# Altium project Common_Sensor_Box.PrjPCB (part 6 of 17)

## Sheet Sensor_Box_PWR_DC.SchDoc: Title
size 420 x 297 mm; Author: G.Kasprowicz; CompanyName: WUT ISE; DrawnBy: G.Kasprowicz; Organization: WUT ISE; Address1: PW ISE; Address2: Nowowiejska 15/19 00-665 Warsaw; Address3: gkasprow@gmail.com; Revision: 1.0; SheetNumber: -; SheetTotal: -; ModifiedBy: -; CheckedDate: -; Title2: Title2; DivGrp: WUT ISE; Designer: G.Kasprowicz; ModifiedDate: -; ProjectName: Sensor Box
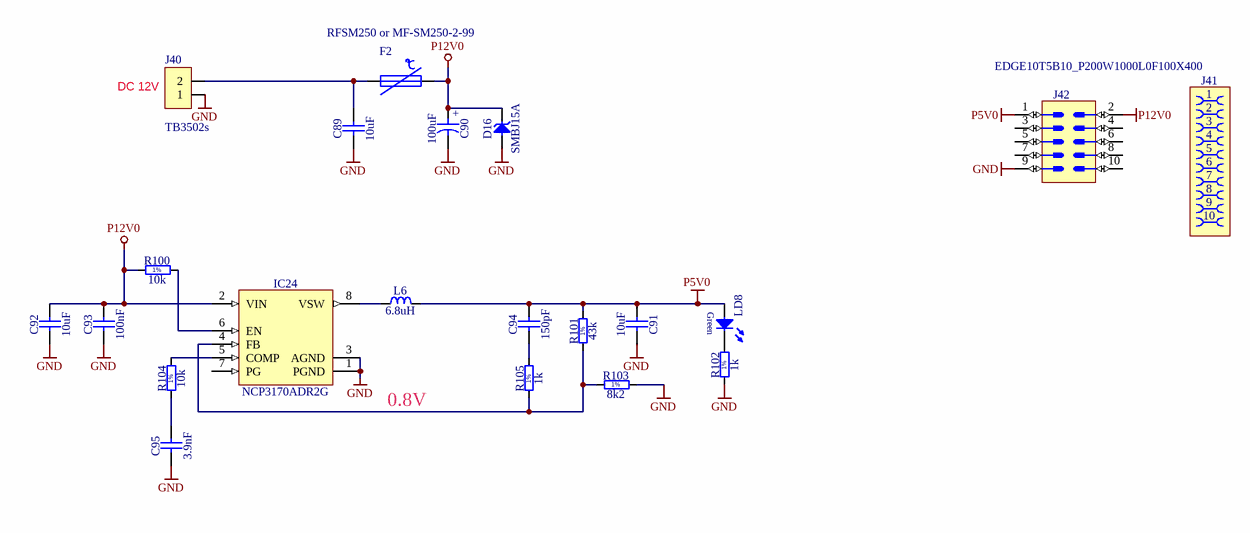
[diagram p9: Sensor_Box_PWR_DC.SchDoc]

### Parts
C89  10uF  [CAPC2012X135N]
C90  100uF  [CAPAE660X540N]
C91  10uF  [CAPC2012X135N]
C92  10uF  [CAPC2012X135N]
C93  100nF  [CAPC1005X55N]
C94  150pF  [CAPC1608X87N]
C95  3.9nF  [CAPC1608X87N]
D16  SMBJ15A  [DIOM5336X265N]
F2  RFSM250 or MF-SM250-2-99  [SMD150-2]
IC24  NCP3170ADR2G  [SOIC127P600X175-8N]
J40  TB3502s  [tbx3502s]
J41  (no value)  [AVX_00 9159 010 061 916]
J42  (no value)  [EDGE10T5B10_P200W1000L0F100X400]
L6  6.8uH  [IND_BOURNS_SRU8043]
LD8  Green  [LED_KINGBRIGHT_KPTR3216]  (value not drawn)
R100  10k  [RESC1005X40N]
R101  43k  [RESC1608X55N]
R102  1k  [RESC1005X40N]
R103  8k2  [RESC1608X55N]
R104  10k  [RESC1005X40N]
R105  1k  [RESC1005X40N]

### Nets
GND: C89.1 C90.2 C91.2 C92.1 C93.1 C95.1 D16.2(A) IC24.1(PGND) IC24.3(AGND) J40.1 J42.9 R102.1 R103.2
P5V0: C91.1 C94.2 J42.1 L6.2 LD8.2(A) R101.2
P12V0: C90.1 C92.2 C93.2 D16.1(C) F2.2 IC24.2(VIN) J42.2 R100.1
NetC89_2: C89.2 F2.1 J40.2
NetC94_1: C94.1 R105.2
NetC95_2: C95.2 R104.1
NetIC24_4: IC24.4(FB) R101.1 R103.1 R105.1
NetIC24_5: IC24.5(COMP) R104.2
NetIC24_6: IC24.6(EN) R100.2
NetIC24_8: IC24.8(VSW) L6.1
NetLD8_1: LD8.1(C) R102.2

Not connected (* = marked no-connect by the designer): IC24 7(PG); J42 3 4 5 6 7 8 10

### Notes on the sheet
- (near J40) DC 12V
- 0.8V
- Project/Equipment
- Document
- Designer
- Drawn by
- Check.by
- Copyright WUT ISE 2018.
  This documentation describes Open Hardware and is licensed under the CERN OHL v.1.1. You may redistribute and modify this documentation under the terms of the CERN OHL v.1.1. (http://ohwr.org/CERNOHL). This documentation is distributed WITHOUT ANY EXPRESS OR IMPLIED WARRANTY, INCLUDING OF MERCHANTABILITY, SATISFACTORY QUALITY AND FITNESS FOR A PARTICULAR PURPOSE. Please see the CERN OHL v.1.1 for applicable conditions.
- Contact
- File
- Last Mod.
- Print Date
- Sheet
- Size
- A3
- of
- Rev
- (in symbol CAE660-540_100UF_16V_20%) +
- (in symbol R0402_1K_1%_0.0625W_100PPM) 1%
- (in symbol R0402_10K_1%_0.0625W_100PPM) 1%
- (in symbol R0603_8K2_1%_0.1W_100PPM) 1%
- (in symbol R0603_43K_1%_0.1W_100PPM) 1%

### Library data of the parts
C89 C91 C92 = CC0805_10UF_16V_10%_X5R: as C56 on sheet Sensor_Box_Hub_SAMD21; Part Number: CC0805_10UF_16V_10%_X5R; Component Kind: Standard; Component Type: Standard; Pin Count: 2; Value: 10uF; Status: Preferred; Manufacturer Part Number: CC0805_10UF_16V_10%_X5R; Case: 0805; Mounted: Yes; Socket: No; SMD: Yes; Sense: No; Manufacturer1 Example: KEMET; Manufacturer1 ComponentHeight: 1.4mm; HelpURL: \\cern.ch\dfs\Applications\Altium\Datasheets\CC1206_X5R_KEMET.pdf; Author: CERN DEM JLC; CreateDate: 03.12.2007; LatestRevisionDate: 03.12.2007
C90 = CAE660-540_100UF_16V_20%: as C58 on sheet Sensor_Box_PoE; Part Number: CAE660-540_100UF_16V_20%; Component Kind: Standard; Component Type: Standard; Pin Count: 2; Value: 100uF; Status: Not Recommended; Case: D; Mounted: Yes; Socket: No; SMD: Yes; Sense: No; ComponentHeight: 5.8mm; HelpURL: \\cern.ch\dfs\Applications\Altium\Datasheets\CAE_PANASONIC_FK.pdf; Author: CERN DEM JLC; CreateDate: 03.12.2007; LatestRevisionDate: 05.11.2014
C93 = CC0402_100NF_16V_10%_X5R: as C41 on sheet Sensor_Box_Hub_SAMD21; Part Number: CC0402_100NF_16V_10%_X5R; Component Kind: Standard; Component Type: Standard; Pin Count: 2; Value: 100nF; Status: None; Manufacturer Part Number: CC0402_100NF_16V_10%_X5R; Case: 0402; Mounted: Yes; Socket: No; SMD: Yes; Sense: No; Manufacturer1 Example: MURATA; Manufacturer1 ComponentHeight: 0.55mm; HelpURL: \\cern.ch\dfs\Applications\Altium\Datasheets\CC0402_X5R_MURATA_GRM.pdf; Author: CERN DEM JLC; CreateDate: 10.12.2013; LatestRevisionDate: 10.12.2013
C94 = CC0603_150PF_50V_1%_NP0: as C81 on sheet Sensor_Box_PoE; Part Number: CC0603_150PF_50V_1%_NP0; Component Kind: Standard; Component Type: Standard; Pin Count: 2; Value: 150pF; Status: None; Manufacturer Part Number: CC0603_150PF_50V_1%_NP0; Case: 0603; Mounted: Yes; Socket: No; SMD: Yes; Sense: No; Manufacturer1 Example: PHYCOMP; Manufacturer1 ComponentHeight: 0.7mm; HelpURL: \\cern.ch\dfs\Applications\Altium\Datasheets\CC0805_NP0_PHYCOMP_16VTO50V.pdf; Author: CERN DEM MR; CreateDate: 17.02.2016; LatestRevisionDate: 17.02.2016
C95 = CC0603_3.9NF_50V_5%_X7R: as C69#1 on sheet Sensor_Box_PoE; Part Number: CC0603_3.9NF_50V_5%_X7R; Component Kind: Standard; Component Type: Standard; Pin Count: 2; Value: 3.9nF; Status: Preferred; Manufacturer Part Number: CC0603_3.9NF_50V_5%_X7R; Case: 0603; Mounted: Yes; Socket: No; SMD: Yes; Sense: No; Manufacturer1 Example: PHYCOMP; Manufacturer1 ComponentHeight: 0.87mm; HelpURL: \\cern.ch\dfs\Applications\Altium\Datasheets\CC0603_X7R_PHYCOMP.pdf; Author: CERN DEM JLC; CreateDate: 03.12.2007; LatestRevisionDate: 03.12.2007
D16 = SMBJ15A: Zener Diode; Part Description: Uni-Directional Transient Voltage Suppressor Diode; Manufacturer: FAIRCHILD SEMICONDUCTOR; Voltage: 15V; Power: 600W; PressFit: No; Bonding: No; Part Number: SMBJ15A; Component Kind: Standard; Component Type: Standard; Device: SMBJ15A; PackageDescription: DO-214-AA/SMB Diode, Molded Body; 5.34mm L X 3.625mm W X 2.65mm H, IPC Medium Density; Manufacturer Part Number: SMBJ15A; Pin Count: 2; Case: DO-214AA; Mounted: Yes; Socket: No; SMD: Yes; Sense: No; ComponentHeight: 2.65mm; HelpURL: \\cern.ch\dfs\Applications\Altium\Datasheets\SMBJ.pdf; Author: CERN DEM JLC; CreateDate: 08.12.2008; LatestRevisionDate: 19.12.2011
F2 = F_PTC_9.5x6mm: 2.50A/15V; Supplier 1: Newark; Supplier Part Number 1: 61J7435
IC24 = NCP3170ADR2G: as IC21 on sheet Sensor_Box_PoE; Part Number: NCP3170ADR2G; Component Kind: Standard; Component Type: Standard; Device: NCP3170ADR2G; PackageDescription: SOIC 8, Pitch 1.27mm - Body 4x5mm, IPC Medium Density; Part Description: Synchronous PWM Switching Converter; Manufacturer Part Number: NCP3170ADR2G; Pin Count: 8; Case: SOIC8; Mounted: Yes; Socket: No; SMD: Yes; Sense: No; ComponentHeight: 1.75mm; Author: CERN DEM MR; HelpURL: \\cern.ch\dfs\Applications\Altium\Datasheets\NCP3170ADR2G.pdf; CreateDate: 30.05.2016; LatestRevisionDate: 30.05.2016
J40 = CON_TB2: Terminal Block
J41 = AVX_00 9159 010 061 916: as J32 on sheet Sensor_Box_PoE; Part Number: AVX_00 9159 010 061 916; Component Kind: Standard; Component Type: Standard; Pin Count: 10; Mounted: Yes; Socket: No; SMD: No; Sense: No; Status: None; Manufacturer Part Number: 00 9159 010 061 916; ComponentHeight: 1.6mm; HelpURL: \\cern.ch\dfs\Applications\Altium\Datasheets\AVX_00 9159 010 061 916.pdf; Author: CERN DEM MR; CreateDate: 13.02.2018; LatestRevisionDate: 13.02.2018
J42 = EDGE10T5B10_P200W1000L0F100X400: as J26 on sheet Sensor_Box_Hub_SAMD21; Part Number: EDGE10T5B10_P200W1000L0F100X400; Component Kind: Standard (No BOM); Component Type: Standard (No BOM); Pin Count: 10; Socket: No; SMD: No; Sense: No; Status: None; ComponentHeight: 0mm; HelpURL: \\cern.ch\dfs\Applications\Altium\Datasheets\EDGE10T5B10_P200W1000L0F100X400.pdf; Author: CERN DEM MR; CreateDate: 14.02.2018; LatestRevisionDate: 14.02.2018
L6 = IND_6.8UH_30%_BOURNS_SRU8043: as L4 on sheet Sensor_Box_PoE; Part Number: IND_6.8UH_30%_BOURNS_SRU8043; Component Kind: Standard; Component Type: Standard; Pin Count: 2; Value: 6.8uH; Status: None; Mounted: Yes; Socket: No; SMD: Yes; Sense: No; ComponentHeight: 4.6mm; HelpURL: \\cern.ch\dfs\Applications\Altium\Datasheets\IND_BOURNS_SRU8043.pdf; Author: CERN DEM JMW; CreateDate: 06.08.2015; LatestRevisionDate: 06.08.2015
LD8 = LED_KINGBRIGHT_KPTR-3216CGCK: as LD3-LD5 on sheet Sensor_Box_Hub_SAMD21; Part Number: LED_KINGBRIGHT_KPTR-3216CGCK; Component Kind: Standard; Component Type: Standard; Color: Green; PackageDescription: Reverse Mount LED 3216, Hole 2.1x2.3mm 0.35mm Height; Manufacturer: KINGBRIGHT; Manufacturer Part Number: KPTR-3216CGCK; Pin Count: 2; Mounted: Yes; Socket: No; SMD: Yes; Sense: No; ComponentHeight: 0.35mm; HelpURL: \\cern.ch\dfs\Applications\Altium\Datasheets\LED_KINGBRIGHT_KPTR-3216CGCK.pdf; Author: CERN DEM MR; CreateDate: 15.02.2016; LatestRevisionDate: 15.02.2016
R100 R104 = R0402_10K_1%_0.0625W_100PPM: as R56 on sheet Sensor_Box_Hub_SAMD21; Part Number: R0402_10K_1%_0.0625W_100PPM; Component Kind: Standard; Component Type: Standard; Pin Count: 2; Value: 10k; Status: Not Recommended; Power: 0.0625W; Tolerance: ±1%; Manufacturer Part Number: R0402_10K_1%_0.0625W_100PPM; Case: 0402; Mounted: Yes; Sense: No; Socket: No; SMD: Yes; Manufacturer1 Example: YAGEO PHYCOMP; Manufacturer1 ComponentHeight: 0.4mm; HelpURL: \\cern.ch\dfs\Applications\Altium\Datasheets\R0402_Phycomp_RC0402.pdf; Author: CERN DEM JLC; CreateDate: 03.12.2007; LatestRevisionDate: 17.10.2012
R101 = R0603_43K_1%_0.1W_100PPM: as R90 on sheet Sensor_Box_PoE; Part Number: R0603_43K_1%_0.1W_100PPM; Component Kind: Standard; Component Type: Standard; Pin Count: 2; Value: 43k; Status: Preferred; Tolerance: ±1%; Manufacturer Part Number: R0603_43K_1%_0.1W_100PPM; Case: 0603; Mounted: Yes; Sense: No; Socket: No; SMD: Yes; Manufacturer1 Example: NIC COMPONENT; Manufacturer1 ComponentHeight: 0.55mm; HelpURL: \\cern.ch\dfs\Applications\Altium\Datasheets\R0603_NIC_NRC.pdf; Author: CERN DEM JLC; CreateDate: 03.12.2007; LatestRevisionDate: 13.03.2008
R102 R105 = R0402_1K_1%_0.0625W_100PPM: as R12 on sheet Sensor_Box_Hub_SAMD21; Part Number: R0402_1K_1%_0.0625W_100PPM; Component Kind: Standard; Component Type: Standard; Pin Count: 2; Value: 1k; Status: Not Recommended; Power: 0.0625W; Tolerance: ±1%; Manufacturer Part Number: R0402_1K_1%_0.0625W_100PPM; Case: 0402; Mounted: Yes; Sense: No; Socket: No; SMD: Yes; Manufacturer1 Example: YAGEO PHYCOMP; Manufacturer1 ComponentHeight: 0.4mm; HelpURL: \\cern.ch\dfs\Applications\Altium\Datasheets\R0402_Phycomp_RC0402.pdf; Author: CERN DEM JLC; CreateDate: 03.12.2007; LatestRevisionDate: 17.10.2012
R103 = R0603_8K2_1%_0.1W_100PPM: as R91 on sheet Sensor_Box_PoE; Part Number: R0603_8K2_1%_0.1W_100PPM; Component Kind: Standard; Component Type: Standard; Pin Count: 2; Value: 8k2; Status: Preferred; Tolerance: ±1%; Manufacturer Part Number: R0603_8K2_1%_0.1W_100PPM; Case: 0603; Mounted: Yes; Sense: No; Socket: No; SMD: Yes; Manufacturer1 Example: NIC COMPONENT; Manufacturer1 ComponentHeight: 0.55mm; HelpURL: \\cern.ch\dfs\Applications\Altium\Datasheets\R0603_NIC_NRC.pdf; Author: CERN DEM JLC; CreateDate: 03.12.2007; LatestRevisionDate: 13.03.2008

## Sheet Sensor_Box_IO_Relay.SchDoc: Title
size 420 x 297 mm; Author: G.Kasprowicz; CompanyName: WUT ISE; DrawnBy: G.Kasprowicz; Organization: WUT ISE; Address1: PW ISE; Address2: Nowowiejska 15/19 00-665 Warsaw; Address3: gkasprow@gmail.com; Revision: 1.0; SheetNumber: -; SheetTotal: -; ModifiedBy: -; CheckedDate: -; Title2: Title2; DivGrp: WUT ISE; Designer: G.Kasprowicz; ModifiedDate: -; ProjectName: Sensor Box
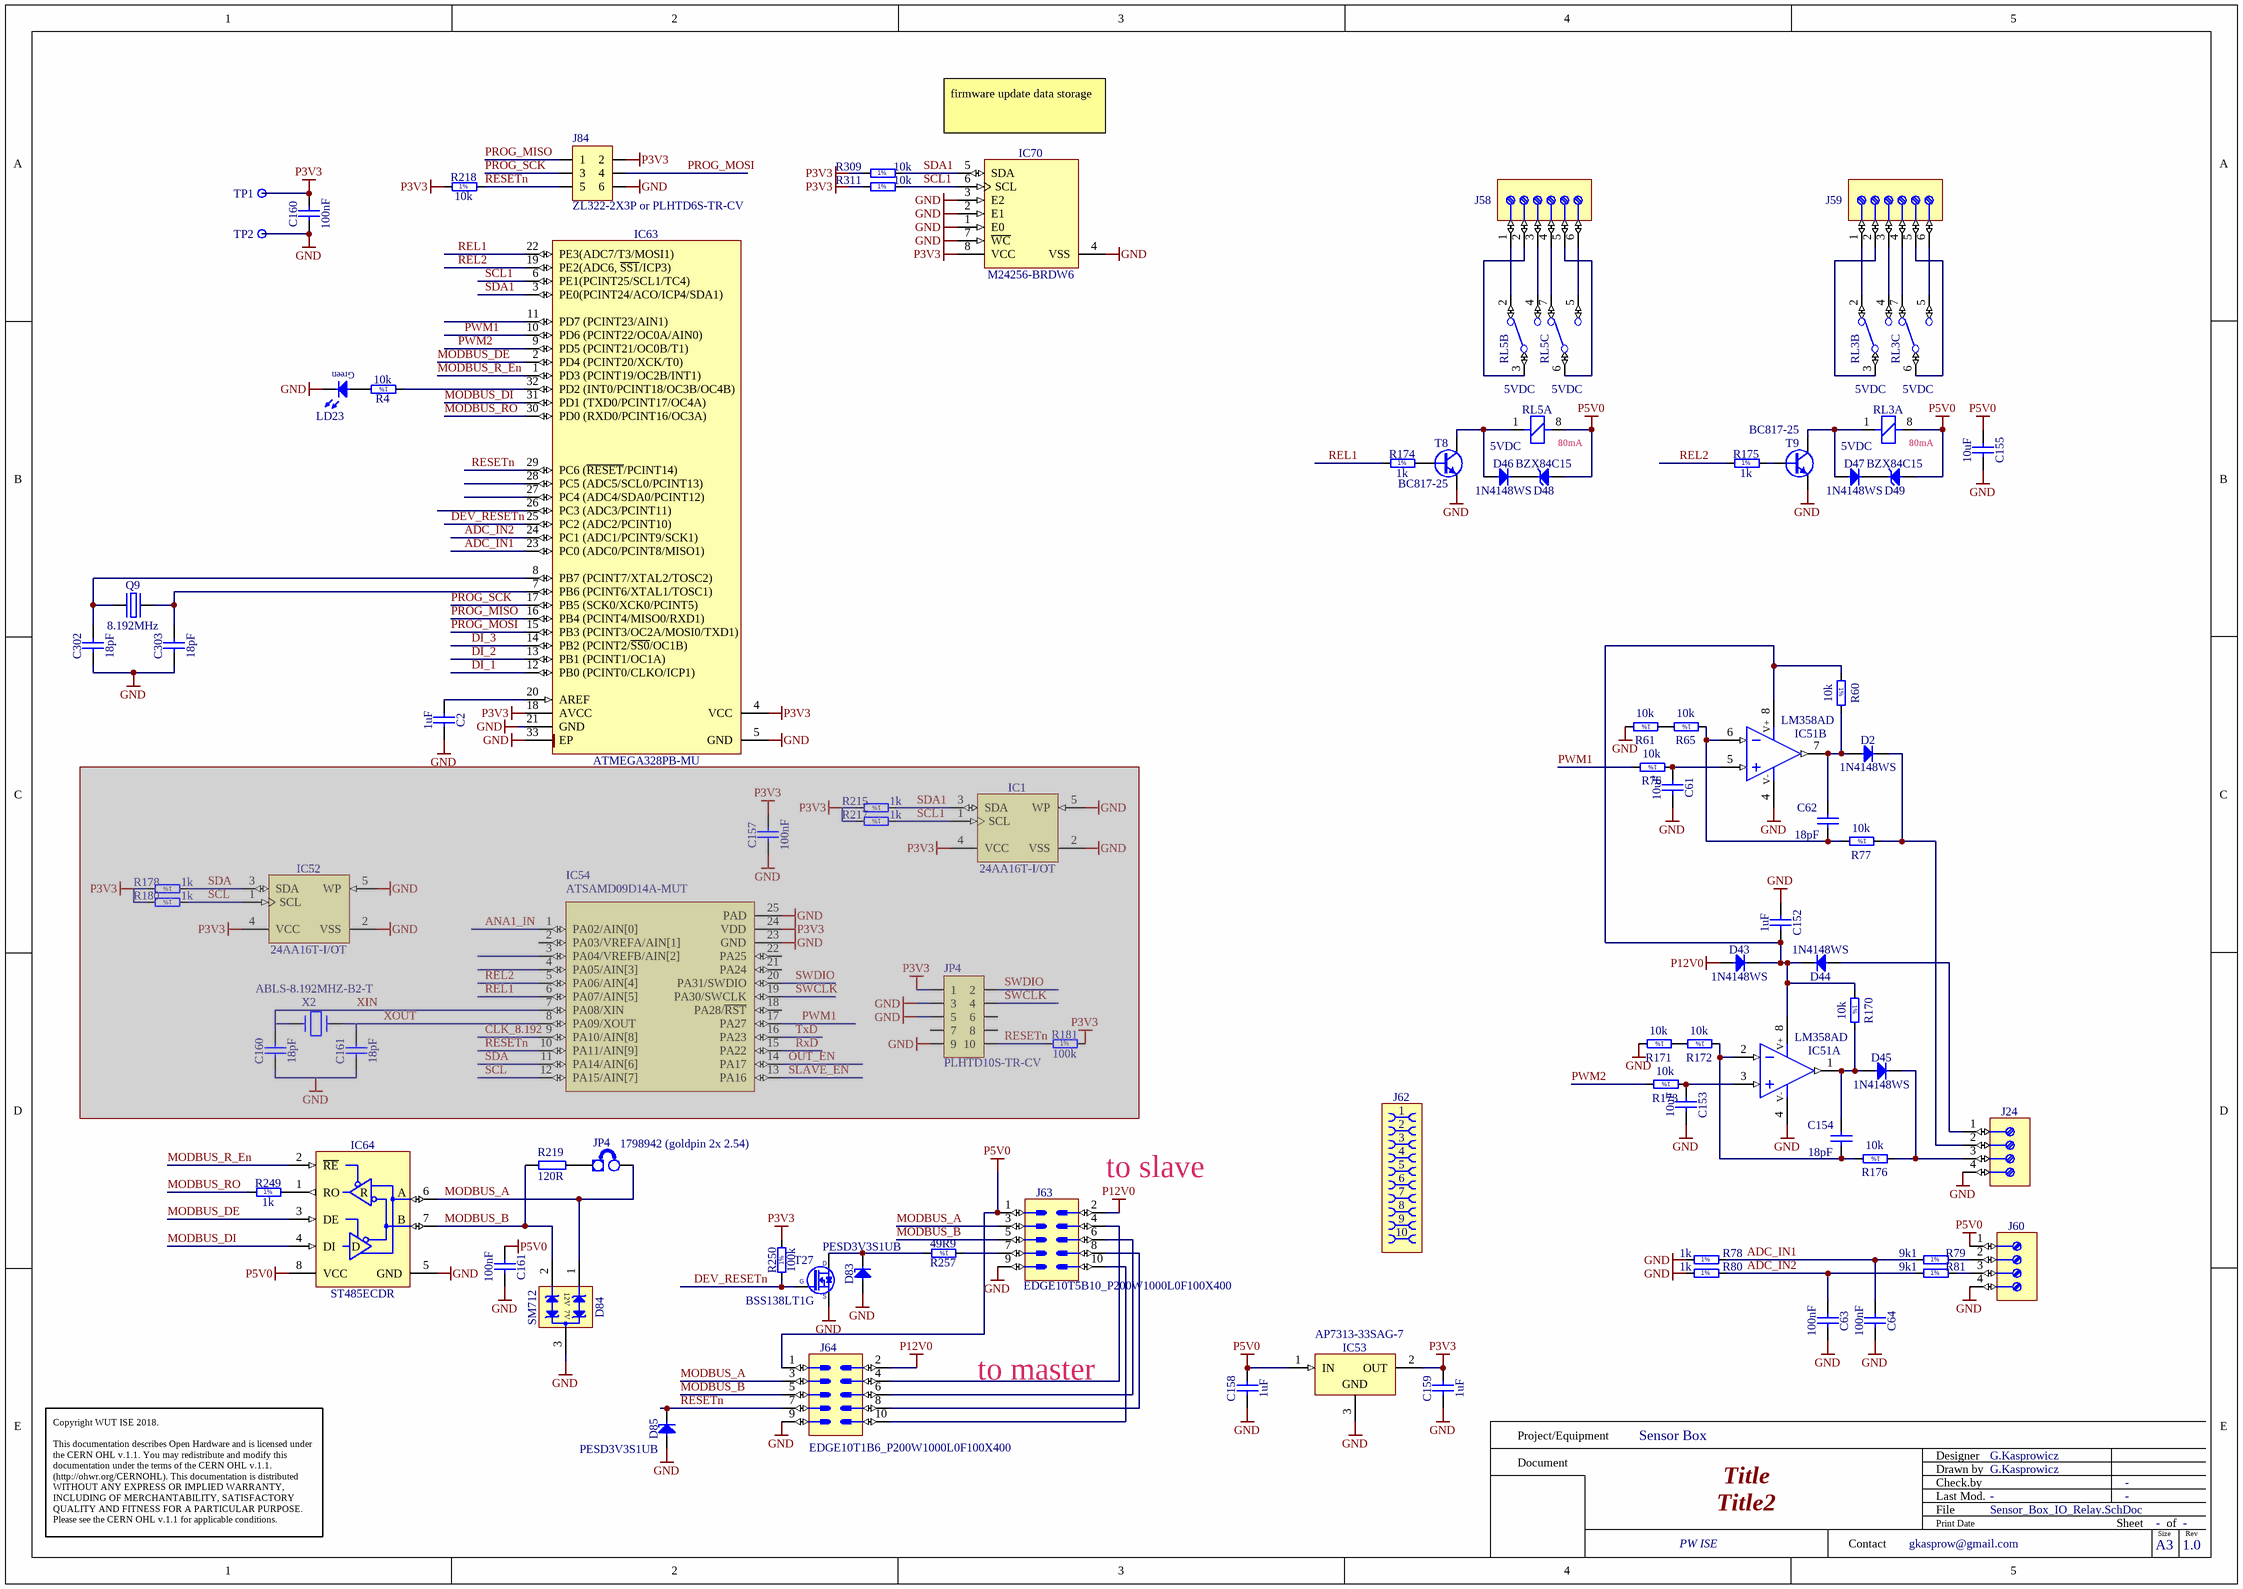
[diagram p10: Sensor_Box_IO_Relay.SchDoc]

### Parts
(Parts that share a designator on the sheet are numbered #1, #2 ... from top to bottom, then left to right.)
C2  1uF  [CAPC1005X55N]
C61#2  10uF  [CAPC2012X135N]
C62#2  18pF  [CAPC1005X55N]
C63#2  100nF  [CAPC1005X55N]
C64#2  100nF  [CAPC1005X55N]
C152  1uF  [CAPC1005X55N]
C153  10uF  [CAPC2012X135N]
C154  18pF  [CAPC1005X55N]
C155  10uF  [CAPC2012X135N]
C157#1  100nF  [CAPC1005X55N]  (masked out: inside a compile mask, not in the netlist)
C158  1uF  [CAPC1005X55N]
C159  1uF  [CAPC1005X55N]
C160#1  100nF  [CAPC1005X55N]
C160#2  18pF  [CAPC1005X55N]  (masked out: inside a compile mask, not in the netlist)
C161#1  18pF  [CAPC1005X55N]  (masked out: inside a compile mask, not in the netlist)
C161#2  100nF  [CAPC1005X55N]
C302  18pF  [CAPC1005X55N]
C303  18pF  [CAPC1005X55N]
D2  1N4148WS  [SODFL2512X100N]
D43  1N4148WS  [SODFL2512X100N]
D44  1N4148WS  [SODFL2512X100N]
D45  1N4148WS  [SODFL2512X100N]
D46  1N4148WS  [SODFL2512X100N]
D47  1N4148WS  [SODFL2512X100N]
D48  BZX84C15  [SOT95P240X130-3N]
D49  BZX84C15  [SOT95P240X130-3N]
D83  PESD3V3S1UB  [SODFL1608X65N]
D84  SM712  [SOT95P237X112-3N]
D85  PESD3V3S1UB  [SODFL1608X65N]
IC1#2  24AA16T-I/OT  [SOT95P280X145-5N]  (masked out: inside a compile mask, not in the netlist)
IC51  LM358AD  [SOIC127P600X175-8N]  (parts A,B of 2)
IC52#2  24AA16T-I/OT  [SOT95P280X145-5N]  (masked out: inside a compile mask, not in the netlist)
IC53  AP7313-33SAG-7  [SOT95P240X130-3N]
IC54#2  ATSAMD09D14A-MUT  [QFN50P400X400X80_HS-25N]  (masked out: inside a compile mask, not in the netlist)
IC63#1  ATMEGA328PB-MU  [QFN50P500X500X100-33N-S325]
IC64#1  ST485ECDR  [SOIC127P600X175-8N]
IC70  M24256-BRDW6  [SOP65P640X120-8N]
J24  (no value)  [PHOENIX_1725672]
J58  (no value)  [PHOENIX_1751138]
J59  (no value)  [PHOENIX_1751138]
J60  (no value)  [PHOENIX_1725672]
J62  (no value)  [AVX_00 9159 010 061 916]
J63  (no value)  [EDGE10T5B10_P200W1000L0F100X400]
J64  (no value)  [EDGE10T1B6_P200W1000L0F100X400]
J84  ZL322-2X3P or PLHTD6S-TR-CV  [ZL322-2X3P]
JP4#1  PLHTD10S-TR-CV  [PLHTD10S-TR-CV]  (masked out: inside a compile mask, not in the netlist)
JP4#2  1798942 (goldpin 2x 2.54)  [jump]
LD23  Green  [LED_KINGBRIGHT_KPTR3216]  (value not drawn)
Q9  8.192MHz  [XTAL_ABRACON_ABLS]
R4  10k  [RESC1005X40N]
R60  10k  [RESC1005X40N]
R61  10k  [RESC1005X40N]
R65  10k  [RESC1005X40N]
R76#2  10k  [RESC1005X40N]
R77#2  10k  [RESC1005X40N]
R78#2  1k  [RESC1005X40N]
R79#2  9k1  [RESC1608X55N]
R80#2  1k  [RESC1005X40N]
R81#2  9k1  [RESC1608X55N]
R170  10k  [RESC1005X40N]
R171  10k  [RESC1005X40N]
R172  10k  [RESC1005X40N]
R173  10k  [RESC1005X40N]
R174  1k  [RESC1005X40N]
R175  1k  [RESC1005X40N]
R176  10k  [RESC1005X40N]
R178#2  1k  [RESC1005X40N]  (masked out: inside a compile mask, not in the netlist)
R180#1  1k  [RESC1005X40N]  (masked out: inside a compile mask, not in the netlist)
R181#1  100k  [RESC1005X40N]  (masked out: inside a compile mask, not in the netlist)
R215#1  1k  [RESC1005X40N]  (masked out: inside a compile mask, not in the netlist)
R217#1  1k  [RESC1005X40N]  (masked out: inside a compile mask, not in the netlist)
R218  10k  [RESC1005X40N]
R219  120R  [1206R]
R249#1  1k  [RESC1005X40N]
R250#1  100k  [RESC1005X40N]
R257#1  49R9  [RESC1005X40N]
R309#1  10k  [RESC1005X40N]
R311#1  10k  [RESC1005X40N]
RL3  5VDC  [REL_OMRON_G2RL-2-5DC]  (parts A,B,C of 3)
RL5  5VDC  [REL_OMRON_G2RL-2-5DC]  (parts A,B,C of 3)
T8  BC817-25  [SOT95P230X110-3N]
T9  BC817-25  [SOT95P230X110-3N]
T27  BSS138LT1G  [SOT95P240X110-3N]
TP1  Test Point  [TPS127]  (value not drawn)
TP2  Test Point  [TPS127]  (value not drawn)
X2#1  ABLS-8.192MHZ-B2-T  [HC-49SM]  (masked out: inside a compile mask, not in the netlist)

### Nets
GND: C2.2 C61#2.2 C63#2.2 C64#2.2 C152.1 C153.2 C155.2 C158.1 C159.1 C160#1.1 C161#2.2 C302.1 C303.1 D83.2(A) D84.3(GND) D85.2(A) IC51.4(V-) IC53.3(GND) IC63#1.5(GND) IC63#1.21(GND) IC63#1.33(EP) IC64#1.5(GND) IC70.1(E0) IC70.2(E1) IC70.3(E2) IC70.4(VSS) IC70.7(~{WC}) J24.4 J60.4 J63.9 J64.9 J84.6 LD23.1(C) R61.2 R78#2.1 R80#2.1 R171.2 T8.2(E) T9.2(E) T27.2(S) TP2.1
P3V3: C159.2 C160#1.2 IC53.2(OUT) IC63#1.4(VCC) IC63#1.18(AVCC) IC70.8(VCC) J84.2 R218.1 R250#1.2 R309#1.1 R311#1.1 TP1.1
P5V0: C155.1 C158.2 C161#2.1 D48.1(A) D49.1(A) IC53.1(IN) IC64#1.8(VCC) J60.1 J63.1 J64.1 RL3.8 RL5.8
P12V0: D43.2(A) J63.2 J64.2
ADC_IN1: C64#2.1 IC63#1.23(PC0_(ADC0/PCINT8/MISO1)) R78#2.2 R79#2.1
ADC_IN2: C63#2.1 IC63#1.24(PC1_(ADC1/PCINT9/SCK1)) R80#2.2 R81#2.1
DEV_RESETn: IC63#1.25(PC2_(ADC2/PCINT10)) R250#1.1 T27.1(G)
DI_1: IC63#1.12(PB0_(PCINT0/CLKO/ICP1))
DI_2: IC63#1.13(PB1_(PCINT1/OC1A))
DI_3: IC63#1.14(PB2_(PCINT2/~{SS0}/OC1B))
MODBUS_A: D84.1(I/O1) IC64#1.6(A) J63.3 J64.3 JP4#2.2(E2)
MODBUS_B: D84.2(I/O2) IC64#1.7(B) J63.5 J64.5 R219.1
MODBUS_DE: IC63#1.2(PD4_(PCINT20/XCK/T0)) IC64#1.3(DE)
MODBUS_DI: IC63#1.31(PD1_(TXD0/PCINT17/OC4A)) IC64#1.4(DI)
MODBUS_R_En: IC63#1.1(PD3_(PCINT19/OC2B/INT1)) IC64#1.2(~{RE})
MODBUS_RO: IC63#1.30(PD0_(RXD0/PCINT16/OC3A)) R249#1.1
PROG_MISO: IC63#1.16(PB4_(PCINT4/MISO0/RXD1)) J84.1
PROG_MOSI: IC63#1.15(PB3_(PCINT3/OC2A/MOSI0/TXD1)) J84.4
PROG_SCK: IC63#1.17(PB5_(SCK0/XCK0/PCINT5)) J84.3
PWM1: IC63#1.10(PD6_(PCINT22/OC0A/AIN0)) R76#2.2
PWM2: IC63#1.9(PD5_(PCINT21/OC0B/T1)) R173.2
REL1: IC63#1.22(PE3(ADC7/T3/MOSI1)) R174.1
REL2: IC63#1.19(PE2(ADC6,_~{SS1}/ICP3)) R175.1
RESETn: D85.1(C) IC63#1.29(PC6_(~{RESET}/PCINT14)) J64.7 J84.5 R218.2
SCL1: IC63#1.6(PE1(PCINT25/SCL1/TC4)) IC70.6(SCL) R311#1.2
SDA1: IC63#1.3(PE0(PCINT24/ACO/ICP4/SDA1)) IC70.5(SDA) R309#1.2
NetC2_1: C2.1 IC63#1.20(AREF)
NetC61#2_1: C61#2.1 IC51.5(IN+) R76#2.1
NetC62#2_1: C62#2.1 D2.2(A) IC51.7(OUT) R60.2
NetC62#2_2: C62#2.2 IC51.6(IN-) R65.1 R77#2.2
NetC152_2: C152.2 D43.1(C) D44.1(C) IC51.8(V+) R60.1 R170.1
NetC153_1: C153.1 IC51.3(IN+) R173.1
NetC154_1: C154.1 D45.2(A) IC51.1(OUT) R170.2
NetC154_2: C154.2 IC51.2(IN-) R172.1 R176.2
NetC302_2: C302.2 IC63#1.8(PB7_(PCINT7/XTAL2/TOSC2)) Q9.1(OSC1)
NetC303_2: C303.2 IC63#1.7(PB6_(PCINT6/XTAL1/TOSC1)) Q9.2(OSC2)
NetD2_1: D2.1(C) J24.2 R77#2.1
NetD44_2: D44.2(A) J24.1
NetD45_1: D45.1(C) J24.3 R176.1
NetD46_1: D46.1(C) D48.3(C)
NetD46_2: D46.2(A) RL5.1 T8.3(C)
NetD47_1: D47.1(C) D49.3(C)
NetD47_2: D47.2(A) RL3.1 T9.3(C)
NetD83_1: D83.1(C) R257#1.2 T27.3(D)
NetIC63#1_32: IC63#1.32(PD2_(INT0/PCINT18/OC3B/OC4B)) R4.1
NetIC64#1_1: IC64#1.1(RO) R249#1.2
NetJ58_1: J58.1 RL5.2(NC)
NetJ58_2: J58.2 RL5.3(C)
NetJ58_3: J58.3 RL5.4(NO)
NetJ58_4: J58.4 RL5.7(NC)
NetJ58_5: J58.5 RL5.6(C)
NetJ58_6: J58.6 RL5.5(NO)
NetJ59_1: J59.1 RL3.2(NC)
NetJ59_2: J59.2 RL3.3(C)
NetJ59_3: J59.3 RL3.4(NO)
NetJ59_4: J59.4 RL3.7(NC)
NetJ59_5: J59.5 RL3.6(C)
NetJ59_6: J59.6 RL3.5(NO)
NetJ60_2: J60.2 R79#2.2
NetJ60_3: J60.3 R81#2.2
NetJ63_4: J63.4 J64.4
NetJ63_6: J63.6 J64.6
NetJ63_7: J63.7 R257#1.1
NetJ63_8: J63.8 J64.8
NetJ63_10: J63.10 J64.10
NetJP4#2_1: JP4#2.1(E1) R219.2
NetLD23_2: LD23.2(A) R4.2
NetR61_1: R61.1 R65.2
NetR171_1: R171.1 R172.2
NetR174_2: R174.2 T8.1(B)
NetR175_2: R175.2 T9.1(B)

Not connected (* = marked no-connect by the designer): IC63#1 11(PD7_(PCINT23/AIN1)) 26(PC3_(ADC3/PCINT11)) 27(PC4_(ADC4/SDA0/PCINT12)) 28(PC5_(ADC5/SCL0/PCINT13))

### Notes on the sheet
- firmware update data storage
- (near RL5) 80mA
- (near RL3) 80mA
- (near J63) to slave
- to master
- Project/Equipment
- Document
- Designer
- Drawn by
- Check.by
- Copyright WUT ISE 2018.
  This documentation describes Open Hardware and is licensed under the CERN OHL v.1.1. You may redistribute and modify this documentation under the terms of the CERN OHL v.1.1. (http://ohwr.org/CERNOHL). This documentation is distributed WITHOUT ANY EXPRESS OR IMPLIED WARRANTY, INCLUDING OF MERCHANTABILITY, SATISFACTORY QUALITY AND FITNESS FOR A PARTICULAR PURPOSE. Please see the CERN OHL v.1.1 for applicable conditions.
- Contact
- File
- Last Mod.
- Print Date
- Sheet
- Size
- A3
- of
- Rev
- (in symbol R0402_1K_1%_0.0625W_100PPM) 1%
- (in symbol R0402_10K_1%_0.0625W_100PPM) 1%
- (in symbol R0402_49R9_1%_0.0625W_100PPM) 1%
- (in symbol R0402_100K_1%_0.0625W_100PPM) 1%
- (in symbol R0603_9K1_1%_0.1W_100PPM) 1%
- (in symbol SM712) 12V; 7V
- (in symbol ST485ECDR) R; D

### Library data of the parts
C2 C152 C158 C159 = CC0402_1UF_16V_10%_X5R: as C55 on sheet Sensor_Box_Hub_SAMD21; Part Number: CC0402_1UF_16V_10%_X5R; Component Kind: Standard; Component Type: Standard; Pin Count: 2; Value: 1uF; Status: Preferred; Manufacturer Part Number: CC0402_1UF_16V_10%_X5R; Case: 0402; Mounted: Yes; Socket: No; SMD: Yes; Sense: No; Manufacturer1 Example: TDK; Manufacturer1 ComponentHeight: 0.55mm; HelpURL: \\cern.ch\dfs\Applications\Altium\Datasheets\CC0402_X5R_TDK_C.pdf; Author: CERN DEM JLC; CreateDate: 25.10.2012; LatestRevisionDate: 25.10.2012
C61#2 C153 C155 = CC0805_10UF_16V_10%_X5R: as C56 on sheet Sensor_Box_Hub_SAMD21; Part Number: CC0805_10UF_16V_10%_X5R; Component Kind: Standard; Component Type: Standard; Pin Count: 2; Value: 10uF; Status: Preferred; Manufacturer Part Number: CC0805_10UF_16V_10%_X5R; Case: 0805; Mounted: Yes; Socket: No; SMD: Yes; Manufacturer1 Example: KEMET; Manufacturer1 ComponentHeight: 1.4mm; HelpURL: \\cern.ch\dfs\Applications\Altium\Datasheets\CC1206_X5R_KEMET.pdf; Author: CERN DEM JLC; CreateDate: 03.12.2007; LatestRevisionDate: 03.12.2007; Sense: No
C62#2 C154 C160#2 C161#1 C302 C303 = CC0402_18PF_50V_5%_C0G: as C45 on sheet Sensor_Box_Hub_SAMD21; Part Number: CC0402_18PF_50V_5%_C0G; Component Kind: Standard; Component Type: Standard; Pin Count: 2; Value: 18pF; Status: Preferred; Manufacturer Part Number: CC0402_18PF_50V_5%_C0G; Case: 0402; Mounted: Yes; Socket: No; SMD: Yes; Sense: No; Manufacturer1 Example: KEMET; Manufacturer1 ComponentHeight: 0.55mm; HelpURL: \\cern.ch\dfs\Applications\Altium\Datasheets\CC0805_C0G_KEMET_(Commercial Grade).pdf; Author: CERN DEM JLC; CreateDate: 04.10.2016; LatestRevisionDate: 04.10.2016
C63#2 C64#2 C161#2 = CC0402_100NF_16V_10%_X7R: as C4 on sheet Sensor_Box_Hub_SAMD21; Part Number: CC0402_100NF_16V_10%_X7R; Component Kind: Standard; Component Type: Standard; Pin Count: 2; Value: 100nF; Status: Not Recommended; Manufacturer Part Number: CC0402_100NF_16V_10%_X7R; Case: 0402; Mounted: Yes; Socket: No; SMD: Yes; Manufacturer1 Example: MURATA; Manufacturer1 ComponentHeight: 0.55mm; HelpURL: \\cern.ch\dfs\Applications\Altium\Datasheets\CC0402_X7R_MURATA_GRM.pdf; Author: CERN DEM JLC; CreateDate: 05.12.2013; LatestRevisionDate: 03.12.2007; Sense: No
C157#1 C160#1 = CC0402_100NF_16V_10%_X5R: as C41 on sheet Sensor_Box_Hub_SAMD21; Part Number: CC0402_100NF_16V_10%_X5R; Component Kind: Standard; Component Type: Standard; Pin Count: 2; Value: 100nF; Status: None; Manufacturer Part Number: CC0402_100NF_16V_10%_X5R; Case: 0402; Mounted: Yes; Socket: No; SMD: Yes; Sense: No; Manufacturer1 Example: MURATA; Manufacturer1 ComponentHeight: 0.55mm; HelpURL: \\cern.ch\dfs\Applications\Altium\Datasheets\CC0402_X5R_MURATA_GRM.pdf; Author: CERN DEM JLC; CreateDate: 10.12.2013; LatestRevisionDate: 10.12.2013
D2 D43-D47 = 1N4148WS: as D3 on sheet Sensor_Box_Hub_SAMD21; Part Number: 1N4148WS; Component Kind: Standard; Component Type: Standard; Device: 1N4148WS; PackageDescription: SODFL Diode; 1.70mm W X 1.25mm L X 1.00mm H body, IPC Medium Density; Manufacturer Part Number: 1N4148WS; Pin Count: 2; Case: SOD-323F; Mounted: Yes; Socket: No; SMD: Yes; Sense: No; ComponentHeight: 1mm; HelpURL: \\cern.ch\dfs\Applications\Altium\Datasheets\1N4148WS.pdf; Author: CERN DEM JLC; CreateDate: 12.05.2011; LatestRevisionDate: 12.05.2011
D48 D49 = BZX84C15: Diode Zener Anode Pin 1 Cathode Pin 3 (Pas de pin 2); Part Description: Zener Diode; Manufacturer: FAIRCHILD SEMICONDUCTOR; Voltage: 15V; Power: 350mW; PressFit: No; Bonding: No; Part Number: BZX84C15; Component Kind: Standard; Component Type: Standard; Device: BZX84C15; PackageDescription: SOT23 3-Leads, Pitch 0.95mm - Body 1.3x2.9mm, IPC Medium Density; Manufacturer Part Number: BZX84C15; Pin Count: 3; Case: SOT23-3; Mounted: Yes; Socket: No; SMD: Yes; Sense: No; ComponentHeight: 1.3mm; HelpURL: \\cern.ch\dfs\Applications\Altium\Datasheets\BZX84C15.pdf; Author: CERN DEM JLC; CreateDate: 30.11.2011; LatestRevisionDate: 30.11.2011
D83 D85 = PESD3V3S1UB: as D5-D7 on sheet Sensor_Box_Hub_SAMD21; Part Number: PESD3V3S1UB; Component Kind: Standard; Component Type: Standard; Device: PESD3V3S1UB; PackageDescription: Ultra Small Outline Diode Flat Lead (SOD-523), Body; 1.2mm L X 0.8mm W X 0.65mm H, IPC Medium Density; Manufacturer Part Number: PESD3V3S1UB; Pin Count: 2; Case: SOD523; Mounted: Yes; Socket: No; SMD: Yes; Sense: No; ComponentHeight: 0.65mm; HelpURL: \\cern.ch\dfs\Applications\Altium\Datasheets\PESD3V3S1UB.pdf; Author: CERN DEM JLC; CreateDate: 29.11.2012; LatestRevisionDate: 29.11.2012
D84 = SM712: as D4 on sheet Sensor_Box_Hub_SAMD21; Part Number: SM712; Component Kind: Standard; Component Type: Standard; Device: SM712; PackageDescription: SOT, 0.95mm, pitch; 3 pin,1.30mm W X 2.92mm L X 1.12mm H body, IPC Medium Density; Status: Obsolete; Part Description: Asymmetrical TVS Diode for Extended Common-Mode RS-485; Manufacturer Part Number: SM712; Pin Count: 3; Case: SOT-23; Mounted: Yes; Socket: No; SMD: Yes; Sense: No; ComponentHeight: 1.12mm; HelpURL: \\cern.ch\dfs\Applications\Altium\Datasheets\SM712.pdf; Author: CERN DEM JLC; CreateDate: 23.04.2012; LatestRevisionDate: 23.04.2012
IC1#2 IC52#2 = MEM_24AA16T_SOT23: 1.7V-5.5V, 2K I2C Serial EEPROM With EUI-48 Node Identity; Part Description: 1.7V-5.5V, 16K I2C Serial EEPROM; Manufacturer: MICROCHIP TECHNOLOGY; PressFit: No; Bonding: No; Part Number: 24AA16T-I/OT; Component Kind: Standard; Component Type: Standard; Device: 24AA16T-I/OT; PackageDescription: SOT, 0.95mm pitch; 5 pin, 1.60mm W X 2.90mm L X 1.45mm H body, IPC Medium Density; Manufacturer Part Number: 24AA16T-I/OT; Pin Count: 5; Case: SOT23-5; Mounted: Yes; Socket: No; SMD: Yes; Sense: No; ComponentHeight: 1.45mm; HelpURL: \\cern.ch\dfs\Applications\Altium\Datasheets\24AA02E48T-I-OT.pdf; Author: GK; CreateDate: 31.03.2016; LatestRevisionDate: 31.03.2016
IC51 = LM358AD: Dual Operational Amplifier; Manufacturer: TEXAS INSTRUMENTS; PressFit: No; Bonding: No; Part Number: LM358AD; Component Kind: Standard; Component Type: Standard; Device: LM358AD; PackageDescription: SOIC 8, Pitch 1.27mm - Body 4x5mm, IPC Medium Density; Part Description: Dual Operational Amplifier; Manufacturer Part Number: LM358AD; Pin Count: 8; Case: SOIC8; Mounted: Yes; Socket: No; SMD: Yes; Sense: No; ComponentHeight: 1.75mm; Author: CERN DEM JLC; HelpURL: \\cern.ch\dfs\Applications\Altium\Datasheets\LM358AD.pdf; CreateDate: 02.12.2008; LatestRevisionDate: 13.04.2010
IC53 = AP7313-33SAG-7: 3-Terminal Regulator 1=IN 2=OUT 3=GND; Part Description: 3.3V, 150mA Low Quiescent Current, Fast Transient Low Dropout Linear Regulator; Manufacturer: DIODES INCORPORATED; PressFit: No; Bonding: No; Part Number: AP7313-33SAG-7; Component Kind: Standard; Component Type: Standard; Device: AP7313-33SAG-7; PackageDescription: SOT23 3-Leads, Pitch 0.95mm - Body 1.3x2.9mm, IPC Medium Density; Manufacturer Part Number: AP7313-33SAG-7; Pin Count: 3; Case: SOT23; Mounted: Yes; Socket: No; SMD: Yes; Sense: No; ComponentHeight: 1.35mm; HelpURL: \\cern.ch\dfs\Applications\Altium\Datasheets\AP7313-33SAG-7.pdf; Author: CERN DEM JLC; CreateDate: 20.03.2018; LatestRevisionDate: 20.03.2018
IC54#2 = UPC_ATSAMD09D: 32-bit ARM®-based Cortex®-M4 core Microcontroller, 1.62V to 3.6V, 120MHz, 256KB Flash, 64KB of SRAM, 48 QFP, Industrial Grade (-40°C to 85°C); Part Description: ATSAMD09D14A-MUT  SMART SAMD09, SMART ARM based Microcontrollers, 32 bity, 48 MHz, 16 KB, 4 KB; Manufacturer: Microchip; PressFit: No; Bonding: No; Part Number: ATSAMD09D14A-MUT; Component Kind: Standard; Component Type: Standard; Device: ATSAMD09D14A-MUT; PackageDescription: QFN, 24-Leads, Body 4.00x4.00mm, Pitch 0.50mm, Thermal Pad 2.60x2.60mm, IPC Medium Density; Manufacturer Part Number: ATSAMD09D14A-MUT; Pin Count: 24; Case: QFN24; Mounted: Yes; Socket: No; SMD: Yes; Sense: No; ComponentHeight: 1.6mm; HelpURL: \\cern.ch\dfs\Applications\Altium\Datasheets\ATSAM4S4AA-AU.pdf; Author: GK; CreateDate: 16.12.2017; LatestRevisionDate: 16.12.2017
IC63#1 = UPC_ATMEGA328PB-MU: 8-bit AVR 20MHz Microcontroller With 32K Bytes In-System  Programmable  Flash; Part Description: 8-bit AVR Microcontroller, 32KB Flash, 1KB EEPROM, 2KB SRAM, 32-pin MLF, Industrial Grade (-40°C to 85°C); Manufacturer: ATMEL; PressFit: No; Bonding: No; Part Number: ATMEGA328PB-MU; Component Kind: Standard; Component Type: Standard; Device: ATMEGA328PB-MU; PackageDescription: QFN, (MO-220-VHHD-2) 0.50mm pitch,square; 8 pin X 8 pin, 5mm X 5mm X 1.00mm H body (w/thermal tab 3.25 X 3.25mm),  IPC Medium Density; Manufacturer Part Number: ATMEGA328PB-MU; Pin Count: 33; Case: QFN32; Mounted: Yes; Socket: No; SMD: Yes; Sense: No; ComponentHeight: 1mm; HelpURL: \\cern.ch\dfs\Applications\Altium\Datasheets\ATMEGA328P-MU.pdf; Author: GK; CreateDate: 2011-02-08; LatestRevisionDate: 2014-07-02
IC64#1 = ST485ECDR: as IC15 on sheet Sensor_Box_Hub_SAMD21; Part Number: ST485ECDR; Component Kind: Standard; Component Type: Standard; Device: ST485ECDR; PackageDescription: SOIC 8, Pitch 1.27mm - Body 4x5mm, IPC Medium Density; Part Description: ±15kV ESD-Protected, Low Power  RS-485/RS-422 Transceiver; Manufacturer Part Number: ST485ECDR; Pin Count: 8; Case: SOIC8; Mounted: Yes; Socket: No; SMD: Yes; Sense: No; ComponentHeight: 1.75mm; Author: CERN DEM MR; HelpURL: \\cern.ch\dfs\Applications\Altium\Datasheets\ST485ECDR.pdf; CreateDate: 15.02.2018; LatestRevisionDate: 15.02.2018
IC70 = MEM_M24256-BRDW6P: as IC2#3 on sheet Sensor_Box_Hub_SAMD21; Part Number: M24256-BRDW6P; Component Kind: Standard; Component Type: Standard; Device: M24256-BRDW6; PackageDescription: SOP, 0.65mm pitch; 8 pin, 4.40mm W X 3.00mm L X 1.20mm H body, IPC Medium Density; Part Description: 256-Kbit Serial I²C Bus EEPROM; Manufacturer Part Number: M24256-BRDW6; Pin Count: 8; Case: TSSOP8; Mounted: Yes; Socket: No; SMD: Yes; Sense: No; ComponentHeight: 1.2mm; HelpURL: \\cern.ch\dfs\Applications\Altium\Datasheets\M24256-BRDW6P.pdf; Author: CERN DEM MR; CreateDate: 17.03.2016; LatestRevisionDate: 17.03.2016
J24 J60 = PHOENIX_1725672: as J23 on sheet Sensor_Box_Hub_SAMD21; Part Number: PHOENIX_1725672; Component Kind: Standard; Component Type: Standard; Pin Count: 4; Mounted: Yes; Socket: No; SMD: No; Sense: No; Status: None; ComponentHeight: 8.5mm; HelpURL: \\cern.ch\dfs\Applications\Altium\Datasheets\PHOENIX_1725672.pdf; Author: CERN DEM JMW; CreateDate: 07.11.2008; LatestRevisionDate: 26.04.2010
J58 J59 = PHOENIX_1751138: Terminal Block, 6 Positions, Screw Connection; Part Description: 10A 200V PCB Terminal Block, Pitch 3.5mm, 6 Positions, Screw Connection (Conductor/PCB connection direction: 55°); Manufacturer: PHOENIX CONTACT; Manufacturer Part Number: 1751138 (SMKDS 1/ 6-3,5); PressFit: No; Part Number: PHOENIX_1751138; Component Kind: Standard; Component Type: Standard; Pin Count: 6; Mounted: Yes; Socket: No; SMD: No; Sense: No; Status: None; ComponentHeight: 9.5mm; HelpURL: \\cern.ch\dfs\Applications\Altium\Datasheets\PHOENIX_1751138.pdf; Author: CERN DEM JLC; CreateDate: 31.03.2015; LatestRevisionDate: 31.03.2015
J62 = AVX_00 9159 010 061 916: as J32 on sheet Sensor_Box_PoE; Part Number: AVX_00 9159 010 061 916; Component Kind: Standard; Component Type: Standard; Pin Count: 10; Mounted: Yes; Socket: No; SMD: No; Sense: No; Status: None; Manufacturer Part Number: 00 9159 010 061 916; ComponentHeight: 1.6mm; HelpURL: \\cern.ch\dfs\Applications\Altium\Datasheets\AVX_00 9159 010 061 916.pdf; Author: CERN DEM MR; CreateDate: 13.02.2018; LatestRevisionDate: 13.02.2018
J63 = EDGE10T5B10_P200W1000L0F100X400: as J26 on sheet Sensor_Box_Hub_SAMD21; Part Number: EDGE10T5B10_P200W1000L0F100X400; Component Kind: Standard (No BOM); Component Type: Standard (No BOM); Pin Count: 10; Socket: No; SMD: No; Sense: No; Status: None; ComponentHeight: 0mm; HelpURL: \\cern.ch\dfs\Applications\Altium\Datasheets\EDGE10T5B10_P200W1000L0F100X400.pdf; Author: CERN DEM MR; CreateDate: 14.02.2018; LatestRevisionDate: 14.02.2018
J64 = EDGE10T1B6_P200W1000L0F100X400: as J27 on sheet Sensor_Box_Hub_SAMD21; Part Number: EDGE10T1B6_P200W1000L0F100X400; Component Kind: Standard (No BOM); Component Type: Standard (No BOM); Pin Count: 10; Socket: No; SMD: No; Sense: No; Status: None; ComponentHeight: 0mm; HelpURL: \\cern.ch\dfs\Applications\Altium\Datasheets\EDGE10T1B6_P200W1000L0F100X400.pdf; Author: CERN DEM MR; CreateDate: 14.02.2018; LatestRevisionDate: 14.02.2018
J84 = CON_2x3 1.27 SMT Male: 1.27 mm dual row goldpin (Maritex)
JP4#1 = CON_2x5 1.27 SMT Male: 1.27 mm dual row goldpin (Maritex)
JP4#2 = JUMPER: Supplier 1: Farnell; Supplier Part Number 1: 1798942
LD23 = LED_KINGBRIGHT_KPTR-3216CGCK: as LD3-LD5 on sheet Sensor_Box_Hub_SAMD21; Part Number: LED_KINGBRIGHT_KPTR-3216CGCK; Component Kind: Standard; Component Type: Standard; Color: Green; PackageDescription: Reverse Mount LED 3216, Hole 2.1x2.3mm 0.35mm Height; Manufacturer: KINGBRIGHT; Manufacturer Part Number: KPTR-3216CGCK; Pin Count: 2; Mounted: Yes; Socket: No; SMD: Yes; Sense: No; ComponentHeight: 0.35mm; HelpURL: \\cern.ch\dfs\Applications\Altium\Datasheets\LED_KINGBRIGHT_KPTR-3216CGCK.pdf; Author: CERN DEM MR; CreateDate: 15.02.2016; LatestRevisionDate: 15.02.2016
Q9 = XTAL_8.192MHZ_ABRACON_ABLS-8.192MHZ-B2-T: Quartz Crystal; Part Description: Tolerance: ± 20ppm, Stability: ± 50ppm, -20°C to +70°C, 18pF, 80 Ohms ESR, Low Profile Surface Mount Microprocessor Crystal, ABLS Series; PressFit: No; Bonding: No; Part Number: XTAL_8.192MHZ_ABRACON_ABLS-8.192MHZ-B2-T; Component Kind: Standard; Component Type: Standard; PackageDescription: SMD Crystal, Body 11.40mm L X 4.70mm W X 4.20mm H, HC/49US (AT49) ALBS Series; Value: 8.192MHz; Manufacturer: ABRACON; Manufacturer Part Number: ABLS-8.192MHZ-B2-T; Pin Count: 2; Mounted: Yes; Socket: No; SMD: Yes; Sense: No; ComponentHeight: 4.2mm; HelpURL: \\cern.ch\dfs\Applications\Altium\Datasheets\XTAL_ABRACON_ABLS.pdf; Author: CERN DEM MR; CreateDate: 15.02.2018; LatestRevisionDate: 15.02.2018
R4 R218 R309#1 R311#1 = R0402_10K_1%_0.0625W_100PPM: as R56 on sheet Sensor_Box_Hub_SAMD21; Part Number: R0402_10K_1%_0.0625W_100PPM; Component Kind: Standard; Component Type: Standard; Pin Count: 2; Value: 10k; Status: Not Recommended; Power: 0.0625W; Tolerance: ±1%; Manufacturer Part Number: R0402_10K_1%_0.0625W_100PPM; Case: 0402; Mounted: Yes; Sense: No; Socket: No; SMD: Yes; Manufacturer1 Example: YAGEO PHYCOMP; Manufacturer1 ComponentHeight: 0.4mm; HelpURL: \\cern.ch\dfs\Applications\Altium\Datasheets\R0402_Phycomp_RC0402.pdf; Author: CERN DEM JLC; CreateDate: 03.12.2007; LatestRevisionDate: 17.10.2012
R60 R61 R65 R76#2 R77#2 R170-R173 R176 = R0402_10K_1%_0.0625W_100PPM: as R62 on sheet Sensor_Box_Hub_SAMD21; Part Number: R0402_10K_1%_0.0625W_100PPM; Component Kind: Standard; Component Type: Standard; Pin Count: 2; Value: 10k; Status: Not recommended; Power: 0.0625W; Tolerance: ±1%; Manufacturer Part Number: R0402_10K_1%_0.0625W_100PPM; Case: 0402; Mounted: Yes; Socket: No; SMD: Yes; Manufacturer1 Example: YAGEO PHYCOMP; Manufacturer1 ComponentHeight: 0.4mm; HelpURL: \\cern.ch\dfs\Applications\Altium\Datasheets\R0402_Phycomp_RC0402.pdf; Author: CERN DEM JLC; CreateDate: 2007-12-03; LatestRevisionDate: 2012-10-17
R78#2 R80#2 R174 R175 R178#2 R180#1 R215#1 R217#1 R249#1 = R0402_1K_1%_0.0625W_100PPM: as R12 on sheet Sensor_Box_Hub_SAMD21; Part Number: R0402_1K_1%_0.0625W_100PPM; Component Kind: Standard; Component Type: Standard; Pin Count: 2; Value: 1k; Status: Not Recommended; Power: 0.0625W; Tolerance: ±1%; Manufacturer Part Number: R0402_1K_1%_0.0625W_100PPM; Case: 0402; Mounted: Yes; Sense: No; Socket: No; SMD: Yes; Manufacturer1 Example: YAGEO PHYCOMP; Manufacturer1 ComponentHeight: 0.4mm; HelpURL: \\cern.ch\dfs\Applications\Altium\Datasheets\R0402_Phycomp_RC0402.pdf; Author: CERN DEM JLC; CreateDate: 03.12.2007; LatestRevisionDate: 17.10.2012
R79#2 R81#2 = R0603_9K1_1%_0.1W_100PPM: Resistor - 1%; Part Description: General Purpose Thick Film Chip Resistor; Manufacturer: GENERIC; Manufacturer1 Part Number: NRC06F9101TRF; Power: 0.1W; TC: ±100ppm/°C; PressFit: No; Part Number: R0603_9K1_1%_0.1W_100PPM; Component Kind: Standard; Component Type: Standard; Pin Count: 2; Value: 9k1; Status: Preferred; Tolerance: ±1%; Manufacturer Part Number: R0603_9K1_1%_0.1W_100PPM; Case: 0603; Mounted: Yes; Sense: No; Socket: No; SMD: Yes; Manufacturer1 Example: NIC COMPONENT; Manufacturer1 ComponentHeight: 0.55mm; HelpURL: \\cern.ch\dfs\Applications\Altium\Datasheets\R0603_NIC_NRC.pdf; Author: CERN DEM JLC; CreateDate: 03.12.2007; LatestRevisionDate: 13.03.2008
R181#1 R250#1 = R0402_100K_1%_0.0625W_100PPM: as R20 on sheet Sensor_Box_Hub_SAMD21; Part Number: R0402_100K_1%_0.0625W_100PPM; Component Kind: Standard; Component Type: Standard; Pin Count: 2; Value: 100k; Status: Not Recommended; Power: 0.0625W; Tolerance: ±1%; Manufacturer Part Number: R0402_100K_1%_0.0625W_100PPM; Case: 0402; Mounted: Yes; Sense: No; Socket: No; SMD: Yes; Manufacturer1 Example: YAGEO PHYCOMP; Manufacturer1 ComponentHeight: 0.4mm; HelpURL: \\cern.ch\dfs\Applications\Altium\Datasheets\R0402_Phycomp_RC0402.pdf; Author: CERN DEM JLC; CreateDate: 03.12.2007; LatestRevisionDate: 17.10.2012
R219 = RES_1206: SMD Resistor; Supplier 1: Newark; Supplier Part Number 1: 39K0871
R257#1 = R0402_49R9_1%_0.0625W_100PPM: as R19 on sheet Sensor_Box_Hub_SAMD21; Part Number: R0402_49R9_1%_0.0625W_100PPM; Component Kind: Standard; Component Type: Standard; Pin Count: 2; Value: 49R9; Status: Not recommended; Power: 0.0625W; Tolerance: ±1%; Manufacturer Part Number: R0402_49R9_1%_0.0625W_100PPM; Case: 0402; Mounted: Yes; Socket: No; SMD: Yes; Manufacturer1 Example: YAGEO PHYCOMP; Manufacturer1 ComponentHeight: 0.4mm; HelpURL: \\cern.ch\dfs\Applications\Altium\Datasheets\R0402_Phycomp_RC0402.pdf; Author: CERN DEM JLC; CreateDate: 2012-10-24; LatestRevisionDate: 2012-10-24
RL3 RL5 = REL_OMRON_G2RL-24: DPDT Power Relay, G2RL Series; Manufacturer: OMRON ELECTRONIC; Manufacturer Part Number: G2RL-2-5DC; PressFit: No; Part Number: REL_OMRON_G2RL-2-5DC; Component Kind: Standard; Component Type: Standard; Pin Count: 8; PackageDescription: 8 Leads, Row Spacing 7.5mm; Body 29mm x 12.7mm, OMRON_G2RL Series; Mounted: Yes; Socket: No; SMD: No; Sense: No; Status: None; Value: 5VDC; Part Description: DPDT Power Relay, G2RL Series; ComponentHeight: 15.7mm; HelpURL: \\cern.ch\dfs\Applications\Altium\Datasheets\REL_OMRON_G2RL-24.pdf; Author: GK; CreateDate: 16.06.2015; LatestRevisionDate: 16.06.2015
T8 T9 = BC817-25: NPN Transistor; Part Description: 45V 500mA NPN General-Purpose Transistor; Manufacturer: NXP SEMICONDUCTORS; PressFit: No; Bonding: No; Part Number: BC817-25; Component Kind: Standard; Component Type: Standard; Device: BC817-25; PackageDescription: SOT23, 3 pin, Pitch 0.95mm - 1.3mm W X 2.9mm L X 1.1mm H, IPC Medium Density; Manufacturer Part Number: BC817-25; Pin Count: 3; Case: SOT23-3; Mounted: Yes; Socket: No; SMD: Yes; Sense: No; ComponentHeight: 1.1mm; HelpURL: \\cern.ch\dfs\Applications\Altium\Datasheets\BC817-25.pdf; Author: CERN DEM JLC; CreateDate: 28.10.2014; LatestRevisionDate: 28.10.2014
T27 = BSS138LT1G: as T24 on sheet Sensor_Box_Hub_SAMD21; Part Number: BSS138LT1G; Component Kind: Standard; Component Type: Standard; Device: BSS138LT1G; PackageDescription: SOT23 3-Leads, Pitch 0.95mm - Body 1.4x3mm, IPC Medium Density; Manufacturer Part Number: BSS138LT1G; Pin Count: 3; Case: SOT23-3; Mounted: Yes; Socket: No; SMD: Yes; Sense: No; ComponentHeight: 1.11mm; HelpURL: \\cern.ch\dfs\Applications\Altium\Datasheets\BSS138LT1G.pdf; Author: CERN DEM JLC; CreateDate: 23.03.2009; LatestRevisionDate: 23.03.2009
TP1 TP2 = SMD_PAD_1.27X1.27MM: Part Description: 1.27mm x 1.27mm PCB Copper Area (SMD Test Point); Mounted: No; Part Number: SMD_PAD_1.27X1.27MM; Component Kind: Standard (No BOM); Component Type: Standard (No BOM); Pin Count: 1; Family: Test Point; Socket: No; SMD: Yes; Sense: No; Status: None; ComponentHeight: 0mm; HelpURL: Undefined; Author: CERN DEM JLC; CreateDate: 12.01.2008; LatestRevisionDate: 12.01.2008; PackageDescription: 1.27mm x 1.27mm PCB Copper Area (SMD Test Point)
X2#1 = X_CRYSTAL_HC49_SMT: Crystal oscillator; Supplier 1: Newark; Supplier Part Number 1: 56P2843

## Sheet Sensor_Box_Simple_IO.SchDoc: Title
size 420 x 297 mm; Author: G.Kasprowicz; CompanyName: WUT ISE; DrawnBy: G.Kasprowicz; Organization: WUT ISE; Address1: PW ISE; Address2: Nowowiejska 15/19 00-665 Warsaw; Address3: gkasprow@gmail.com; Revision: 1.0; SheetNumber: -; SheetTotal: -; ModifiedBy: -; CheckedDate: -; Title2: Title2; DivGrp: WUT ISE; Designer: G.Kasprowicz; ModifiedDate: -; ProjectName: Sensor Box
Used 2 times, as channels U_Sensor_Box_Simple_IO, U_Sensor_Box_Simple_IO. Parts and nets are listed once, with the designators drawn on the sheet.
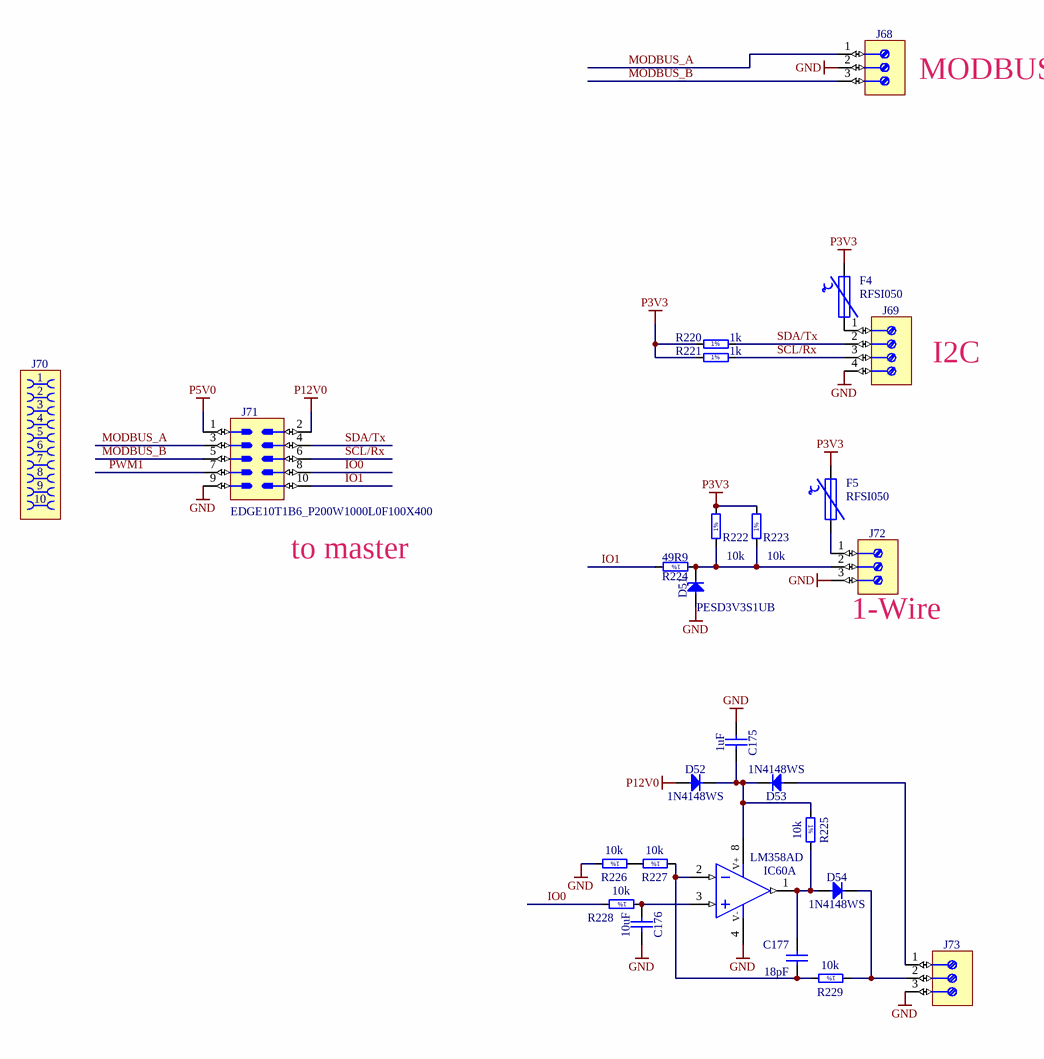
[diagram p11: Sensor_Box_Simple_IO.SchDoc]

### Parts
C175  1uF  [CAPC1005X55N]
C176  10uF  [CAPC2012X135N]
C177  18pF  [CAPC1005X55N]
D51  PESD3V3S1UB  [SODFL1608X65N]
D52  1N4148WS  [SODFL2512X100N]
D53  1N4148WS  [SODFL2512X100N]
D54  1N4148WS  [SODFL2512X100N]
F4  RFSI050  [0805R]
F5  RFSI050  [0805R]
IC60  LM358AD  [SOIC127P600X175-8N]  (part A of 2)
J68  (no value)  [PHOENIX_1725669]
J69  (no value)  [PHOENIX_1725672]
J70  (no value)  [AVX_00 9159 010 061 916]
J71  (no value)  [EDGE10T1B6_P200W1000L0F100X400]
J72  (no value)  [PHOENIX_1725669]
J73  (no value)  [PHOENIX_1725669]
R220  1k  [RESC1005X40N]
R221  1k  [RESC1005X40N]
R222  10k  [RESC1005X40N]
R223  10k  [RESC1005X40N]
R224  49R9  [RESC1005X40N]
R225  10k  [RESC1005X40N]
R226  10k  [RESC1005X40N]
R227  10k  [RESC1005X40N]
R228  10k  [RESC1005X40N]
R229  10k  [RESC1005X40N]

### Nets
GND: C175.1 C176.2 D51.2(A) IC60.4(V-) J68.2 J69.4 J71.9 J72.3 J73.3 R226.2
P3V3: F4.2 F5.2 R220.1 R221.1 R222.2 R223.2
P5V0: J71.1
P12V0: D52.2(A) J71.2
IO0: J71.8 R228.2
IO1: J71.10 R224.2
MODBUS_A: J68.1 J71.3
MODBUS_B: J68.3 J71.5
PWM1: J71.7
SCL/Rx: J69.3 J71.6 R221.2
SDA/Tx: J69.2 J71.4 R220.2
NetC175_2: C175.2 D52.1(C) D53.1(C) IC60.8(V+) R225.1
NetC176_1: C176.1 IC60.3(IN+) R228.1
NetC177_1: C177.1 D54.2(A) IC60.1(OUT) R225.2
NetC177_2: C177.2 IC60.2(IN-) R227.1 R229.2
NetD51_1: D51.1(C) J72.2 R222.1 R223.1 R224.1
NetD53_2: D53.2(A) J73.1
NetD54_1: D54.1(C) J73.2 R229.1
NetF4_1: F4.1 J69.1
NetF5_1: F5.1 J72.1
NetR226_1: R226.1 R227.2

### Channels
U_Sensor_Box_Simple_IO: designators end in _U_Sensor_Box_Simple_IO#1
U_Sensor_Box_Simple_IO: designators end in _U_Sensor_Box_Simple_IO#2

### Notes on the sheet
- MODBUS
- I2C
- (near J71) to master
- (near J72) 1-Wire
- Project/Equipment
- Document
- Designer
- Drawn by
- Check.by
- Copyright WUT ISE 2018.
  This documentation describes Open Hardware and is licensed under the CERN OHL v.1.1. You may redistribute and modify this documentation under the terms of the CERN OHL v.1.1. (http://ohwr.org/CERNOHL). This documentation is distributed WITHOUT ANY EXPRESS OR IMPLIED WARRANTY, INCLUDING OF MERCHANTABILITY, SATISFACTORY QUALITY AND FITNESS FOR A PARTICULAR PURPOSE. Please see the CERN OHL v.1.1 for applicable conditions.
- Contact
- File
- Last Mod.
- Print Date
- Sheet
- Size
- A3
- of
- Rev
- (in symbol R0402_1K_1%_0.0625W_100PPM) 1%
- (in symbol R0402_10K_1%_0.0625W_100PPM) 1%
- (in symbol R0402_49R9_1%_0.0625W_100PPM) 1%

### Library data of the parts
C175 = CC0402_1UF_16V_10%_X5R: as C55 on sheet Sensor_Box_Hub_SAMD21; Part Number: CC0402_1UF_16V_10%_X5R; Component Kind: Standard; Component Type: Standard; Pin Count: 2; Value: 1uF; Status: Preferred; Manufacturer Part Number: CC0402_1UF_16V_10%_X5R; Case: 0402; Mounted: Yes; Socket: No; SMD: Yes; Sense: No; Manufacturer1 Example: TDK; Manufacturer1 ComponentHeight: 0.55mm; HelpURL: \\cern.ch\dfs\Applications\Altium\Datasheets\CC0402_X5R_TDK_C.pdf; Author: CERN DEM JLC; CreateDate: 25.10.2012; LatestRevisionDate: 25.10.2012
C176 = CC0805_10UF_16V_10%_X5R: as C56 on sheet Sensor_Box_Hub_SAMD21; Part Number: CC0805_10UF_16V_10%_X5R; Component Kind: Standard; Component Type: Standard; Pin Count: 2; Value: 10uF; Status: Preferred; Manufacturer Part Number: CC0805_10UF_16V_10%_X5R; Case: 0805; Mounted: Yes; Socket: No; SMD: Yes; Manufacturer1 Example: KEMET; Manufacturer1 ComponentHeight: 1.4mm; HelpURL: \\cern.ch\dfs\Applications\Altium\Datasheets\CC1206_X5R_KEMET.pdf; Author: CERN DEM JLC; CreateDate: 03.12.2007; LatestRevisionDate: 03.12.2007; Sense: No
C177 = CC0402_18PF_50V_5%_C0G: as C45 on sheet Sensor_Box_Hub_SAMD21; Part Number: CC0402_18PF_50V_5%_C0G; Component Kind: Standard; Component Type: Standard; Pin Count: 2; Value: 18pF; Status: Preferred; Manufacturer Part Number: CC0402_18PF_50V_5%_C0G; Case: 0402; Mounted: Yes; Socket: No; SMD: Yes; Sense: No; Manufacturer1 Example: KEMET; Manufacturer1 ComponentHeight: 0.55mm; HelpURL: \\cern.ch\dfs\Applications\Altium\Datasheets\CC0805_C0G_KEMET_(Commercial Grade).pdf; Author: CERN DEM JLC; CreateDate: 04.10.2016; LatestRevisionDate: 04.10.2016
D51 = PESD3V3S1UB: as D5-D7 on sheet Sensor_Box_Hub_SAMD21; Part Number: PESD3V3S1UB; Component Kind: Standard; Component Type: Standard; Device: PESD3V3S1UB; PackageDescription: Ultra Small Outline Diode Flat Lead (SOD-523), Body; 1.2mm L X 0.8mm W X 0.65mm H, IPC Medium Density; Manufacturer Part Number: PESD3V3S1UB; Pin Count: 2; Case: SOD523; Mounted: Yes; Socket: No; SMD: Yes; Sense: No; ComponentHeight: 0.65mm; HelpURL: \\cern.ch\dfs\Applications\Altium\Datasheets\PESD3V3S1UB.pdf; Author: CERN DEM JLC; CreateDate: 29.11.2012; LatestRevisionDate: 29.11.2012
D52-D54 = 1N4148WS: as D3 on sheet Sensor_Box_Hub_SAMD21; Part Number: 1N4148WS; Component Kind: Standard; Component Type: Standard; Device: 1N4148WS; PackageDescription: SODFL Diode; 1.70mm W X 1.25mm L X 1.00mm H body, IPC Medium Density; Manufacturer Part Number: 1N4148WS; Pin Count: 2; Case: SOD-323F; Mounted: Yes; Socket: No; SMD: Yes; Sense: No; ComponentHeight: 1mm; HelpURL: \\cern.ch\dfs\Applications\Altium\Datasheets\1N4148WS.pdf; Author: CERN DEM JLC; CreateDate: 12.05.2011; LatestRevisionDate: 12.05.2011
F4 F5 = F_PTC_0.05A: 50mA polymer FUSE
IC60 = LM358AD: as IC51 on sheet Sensor_Box_IO_Relay; Part Number: LM358AD; Component Kind: Standard; Component Type: Standard; Device: LM358AD; PackageDescription: SOIC 8, Pitch 1.27mm - Body 4x5mm, IPC Medium Density; Part Description: Dual Operational Amplifier; Manufacturer Part Number: LM358AD; Pin Count: 8; Case: SOIC8; Mounted: Yes; Socket: No; SMD: Yes; Sense: No; ComponentHeight: 1.75mm; Author: CERN DEM JLC; HelpURL: \\cern.ch\dfs\Applications\Altium\Datasheets\LM358AD.pdf; CreateDate: 02.12.2008; LatestRevisionDate: 13.04.2010
J68 J72 J73 = PHOENIX_1725669: as J25 on sheet Sensor_Box_Hub_SAMD21; Part Number: PHOENIX_1725669; Component Kind: Standard; Component Type: Standard; Pin Count: 3; Mounted: Yes; Socket: No; SMD: No; Sense: No; Status: None; ComponentHeight: 8.5mm; HelpURL: \\cern.ch\dfs\Applications\Altium\Datasheets\PHOENIX_1725669.pdf; Author: CERN DEM JMW; CreateDate: 07.11.2008; LatestRevisionDate: 26.04.2010
J69 = PHOENIX_1725672: as J23 on sheet Sensor_Box_Hub_SAMD21; Part Number: PHOENIX_1725672; Component Kind: Standard; Component Type: Standard; Pin Count: 4; Mounted: Yes; Socket: No; SMD: No; Sense: No; Status: None; ComponentHeight: 8.5mm; HelpURL: \\cern.ch\dfs\Applications\Altium\Datasheets\PHOENIX_1725672.pdf; Author: CERN DEM JMW; CreateDate: 07.11.2008; LatestRevisionDate: 26.04.2010
J70 = AVX_00 9159 010 061 916: as J32 on sheet Sensor_Box_PoE; Part Number: AVX_00 9159 010 061 916; Component Kind: Standard; Component Type: Standard; Pin Count: 10; Mounted: Yes; Socket: No; SMD: No; Sense: No; Status: None; Manufacturer Part Number: 00 9159 010 061 916; ComponentHeight: 1.6mm; HelpURL: \\cern.ch\dfs\Applications\Altium\Datasheets\AVX_00 9159 010 061 916.pdf; Author: CERN DEM MR; CreateDate: 13.02.2018; LatestRevisionDate: 13.02.2018
J71 = EDGE10T1B6_P200W1000L0F100X400: as J27 on sheet Sensor_Box_Hub_SAMD21; Part Number: EDGE10T1B6_P200W1000L0F100X400; Component Kind: Standard (No BOM); Component Type: Standard (No BOM); Pin Count: 10; Socket: No; SMD: No; Sense: No; Status: None; ComponentHeight: 0mm; HelpURL: \\cern.ch\dfs\Applications\Altium\Datasheets\EDGE10T1B6_P200W1000L0F100X400.pdf; Author: CERN DEM MR; CreateDate: 14.02.2018; LatestRevisionDate: 14.02.2018
R220 R221 = R0402_1K_1%_0.0625W_100PPM: as R12 on sheet Sensor_Box_Hub_SAMD21; Part Number: R0402_1K_1%_0.0625W_100PPM; Component Kind: Standard; Component Type: Standard; Pin Count: 2; Value: 1k; Status: Not Recommended; Power: 0.0625W; Tolerance: ±1%; Manufacturer Part Number: R0402_1K_1%_0.0625W_100PPM; Case: 0402; Mounted: Yes; Sense: No; Socket: No; SMD: Yes; Manufacturer1 Example: YAGEO PHYCOMP; Manufacturer1 ComponentHeight: 0.4mm; HelpURL: \\cern.ch\dfs\Applications\Altium\Datasheets\R0402_Phycomp_RC0402.pdf; Author: CERN DEM JLC; CreateDate: 03.12.2007; LatestRevisionDate: 17.10.2012
R222 R223 R225-R229 = R0402_10K_1%_0.0625W_100PPM: as R62 on sheet Sensor_Box_Hub_SAMD21; Part Number: R0402_10K_1%_0.0625W_100PPM; Component Kind: Standard; Component Type: Standard; Pin Count: 2; Value: 10k; Status: Not recommended; Power: 0.0625W; Tolerance: ±1%; Manufacturer Part Number: R0402_10K_1%_0.0625W_100PPM; Case: 0402; Mounted: Yes; Socket: No; SMD: Yes; Manufacturer1 Example: YAGEO PHYCOMP; Manufacturer1 ComponentHeight: 0.4mm; HelpURL: \\cern.ch\dfs\Applications\Altium\Datasheets\R0402_Phycomp_RC0402.pdf; Author: CERN DEM JLC; CreateDate: 2007-12-03; LatestRevisionDate: 2012-10-17
R224 = R0402_49R9_1%_0.0625W_100PPM: as R19 on sheet Sensor_Box_Hub_SAMD21; Part Number: R0402_49R9_1%_0.0625W_100PPM; Component Kind: Standard; Component Type: Standard; Pin Count: 2; Value: 49R9; Status: Not recommended; Power: 0.0625W; Tolerance: ±1%; Manufacturer Part Number: R0402_49R9_1%_0.0625W_100PPM; Case: 0402; Mounted: Yes; Socket: No; SMD: Yes; Manufacturer1 Example: YAGEO PHYCOMP; Manufacturer1 ComponentHeight: 0.4mm; HelpURL: \\cern.ch\dfs\Applications\Altium\Datasheets\R0402_Phycomp_RC0402.pdf; Author: CERN DEM JLC; CreateDate: 2012-10-24; LatestRevisionDate: 2012-10-24